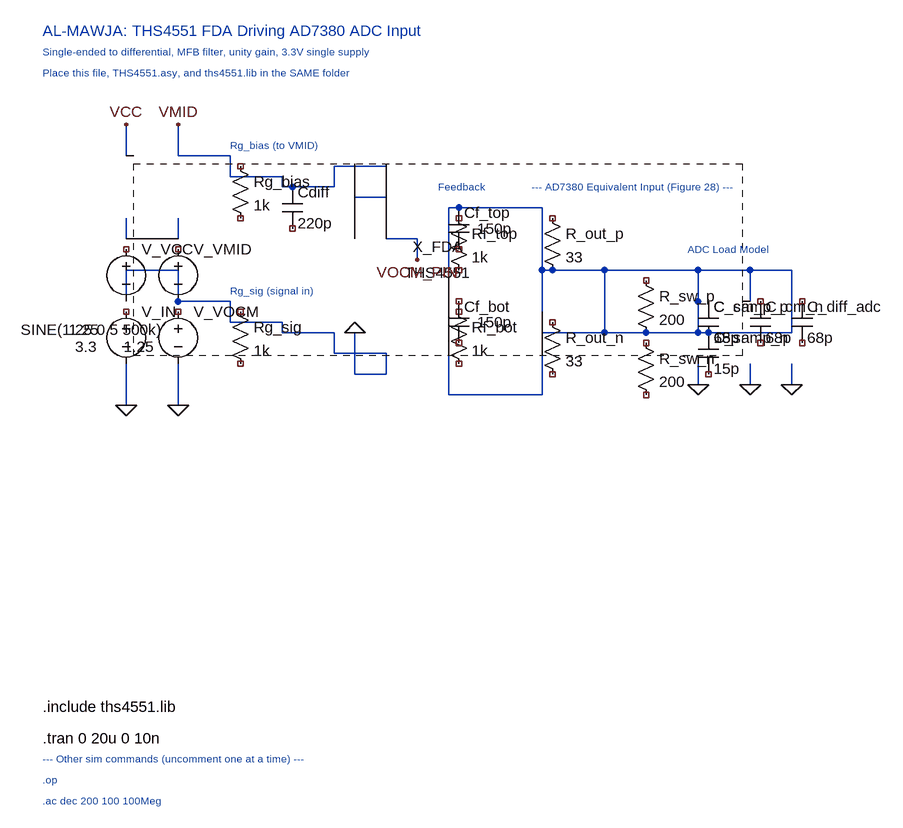
[diagram p0: schematic almawja_graphical.asc]
almawja_graphical.asc, the LTspice schematic file:
Version 4
SHEET 1 1760 1200
TEXT 48 16 Left 2 ;AL-MAWJA: THS4551 FDA Driving AD7380 ADC Input
TEXT 48 48 Left 1 ;Single-ended to differential, MFB filter, unity gain, 3.3V single supply
TEXT 48 80 Left 1 ;Place this file, THS4551.asy, and ths4551.lib in the SAME folder
TEXT 48 1056 Left 2 !.include ths4551.lib
TEXT 48 1104 Left 2 !.tran 0 20u 0 10n
TEXT 48 1136 Left 1 ;--- Other sim commands (uncomment one at a time) ---
TEXT 48 1168 Left 1 ;.op
TEXT 48 1200 Left 1 ;.ac dec 200 100 100Meg
WIRE 176 384 176 432
WIRE 176 528 176 560
WIRE 176 560 176 592
WIRE 176 160 176 208
WIRE 176 304 176 336
WIRE 256 384 176 384
WIRE 256 384 256 432
WIRE 256 528 256 560
WIRE 256 560 256 592
WIRE 256 160 256 208
WIRE 256 304 256 336
WIRE 336 432 256 432
WIRE 336 432 336 464
WIRE 336 208 256 208
WIRE 336 208 336 240
WIRE 416 464 336 464
WIRE 416 464 416 480
WIRE 416 240 336 240
WIRE 416 240 416 256
WIRE 496 480 416 480
WIRE 496 256 416 256
WIRE 496 480 496 512
WIRE 496 256 496 224
WIRE 576 512 496 512
WIRE 576 224 496 224
WIRE 624 336 576 336
WIRE 624 336 624 368
WIRE 576 272 576 224
WIRE 576 272 528 272
WIRE 528 272 528 336
WIRE 576 544 576 512
WIRE 576 544 528 544
WIRE 528 544 528 480
WIRE 672 384 672 288
WIRE 672 288 816 288
WIRE 816 288 816 320
WIRE 672 432 672 576
WIRE 672 576 816 576
WIRE 816 576 816 544
WIRE 816 320 816 384
WIRE 816 384 816 448
WIRE 816 544 816 480
WIRE 912 384 816 384
WIRE 912 384 912 432
WIRE 912 480 816 480
WIRE 912 480 912 432
WIRE 960 384 912 384
WIRE 960 480 912 480
WIRE 1056 384 960 384
WIRE 1056 480 960 480
WIRE 1056 384 1056 432
WIRE 1056 528 1056 560
WIRE 1056 480 1056 432
WIRE 1136 384 1056 384
WIRE 1136 480 1056 480
WIRE 1136 384 1136 432
WIRE 1136 528 1136 560
WIRE 1200 384 1136 384
WIRE 1200 480 1136 480
WIRE 1200 384 1200 432
WIRE 1200 528 1200 560
WIRE 1200 480 1200 432
WIRE 1056 432 1056 480
FLAG 176 592 0
FLAG 256 592 0
FLAG 176 160 VCC
FLAG 256 160 VMID
FLAG 528 480 0
FLAG 624 368 VOCM_PIN
FLAG 1056 560 0
FLAG 1136 560 0
FLAG 1200 560 0
SYMBOL voltage 176 336 R0
WINDOW 3 -78 166 Left 2
SYMATTR InstName V_VCC
SYMATTR Value 3.3
SYMBOL voltage 256 336 R0
WINDOW 3 -84 166 Left 2
SYMATTR InstName V_VMID
SYMATTR Value 1.25
SYMBOL voltage 176 432 R0
WINDOW 3 -162 44 Left 2
SYMATTR InstName V_IN
SYMATTR Value SINE(1.25 0.5 500k)
SYMBOL voltage 256 432 R0
WINDOW 3 -168 44 Left 2
SYMATTR InstName V_VOCM
SYMATTR Value 1.25
SYMBOL res 336 432 R0
SYMATTR InstName Rg_sig
SYMATTR Value 1k
SYMBOL res 336 208 R0
SYMATTR InstName Rg_bias
SYMATTR Value 1k
SYMBOL THS4551 576 384 R0
SYMATTR InstName X_FDA
SYMBOL res 672 288 R0
SYMATTR InstName Rf_top
SYMATTR Value 1k
SYMBOL cap 672 288 R0
WINDOW 3 44 32 Left 2
SYMATTR InstName Cf_top
SYMATTR Value 150p
SYMBOL res 672 432 R0
SYMATTR InstName Rf_bot
SYMATTR Value 1k
SYMBOL cap 672 432 R0
WINDOW 3 44 32 Left 2
SYMATTR InstName Cf_bot
SYMATTR Value 150p
SYMBOL cap 416 256 R0
SYMATTR InstName Cdiff
SYMATTR Value 220p
SYMBOL res 816 288 R0
SYMATTR InstName R_out_p
SYMATTR Value 33
SYMBOL res 816 448 R0
SYMATTR InstName R_out_n
SYMATTR Value 33
SYMBOL cap 1056 432 R0
SYMATTR InstName C_cm_p
SYMATTR Value 68p
SYMBOL cap 1136 432 R0
SYMATTR InstName C_cm_n
SYMATTR Value 68p
SYMBOL cap 1200 432 R0
SYMATTR InstName C_diff_adc
SYMATTR Value 68p
SYMBOL res 960 384 R0
SYMATTR InstName R_sw_p
SYMATTR Value 200
SYMBOL res 960 480 R0
SYMATTR InstName R_sw_n
SYMATTR Value 200
SYMBOL cap 1056 432 R0
SYMATTR InstName C_samp_p
SYMATTR Value 15p
SYMBOL cap 1056 480 R0
SYMATTR InstName C_samp_n
SYMATTR Value 15p
TEXT 800 256 Left 1 ;--- AD7380 Equivalent Input (Figure 28) ---
TEXT 336 192 Left 1 ;Rg_bias (to VMID)
TEXT 336 416 Left 1 ;Rg_sig (signal in)
TEXT 656 256 Left 1 ;Feedback
TEXT 1040 352 Left 1 ;ADC Load Model

The netlist it stands for:
* almawja_graphical.asc
V_VCC NC_01 0 3.3
V_VMID NC_02 0 1.25
V_IN NC_03 0 SINE(1.25 0.5 500k)
V_VOCM NC_04 0 1.25
Rg_sig NC_05 NC_06 1k
Rg_bias NC_07 NC_08 1k
* X_FDA: THS4551 (symbol THS4551 not available, pin order unknown); nets seen at it: 0, N001, N002, N003, VCC, VMID, VOCM_PIN
Rf_top NC_09 NC_10 1k
Cf_top N003 NC_11 150p
Rf_bot NC_12 NC_13 1k
Cf_bot NC_14 NC_15 150p
Cdiff VMID NC_16 220p
R_out_p NC_17 N003 33
R_out_n NC_18 NC_19 33
C_cm_p P001 P002 68p
C_cm_n NC_20 NC_21 68p
C_diff_adc NC_22 NC_23 68p
R_sw_p NC_24 N003 200
R_sw_n NC_25 NC_26 200
C_samp_p P001 P002 15p
C_samp_n N003 NC_27 15p
* AL-MAWJA: THS4551 FDA Driving AD7380 ADC Input
* Single-ended to differential, MFB filter, unity gain, 3.3V single supply
* Place this file, THS4551.asy, and ths4551.lib in the SAME folder
.include ths4551.lib
.tran 0 20u 0 10n
* --- Other sim commands (uncomment one at a time) ---
* .op
* .ac dec 200 100 100Meg
* --- AD7380 Equivalent Input (Figure 28) ---
* Rg_bias (to VMID)
* Rg_sig (signal in)
* Feedback
* ADC Load Model
.backanno
.end